# Altium schematic sheet USB3-HUB.SchDoc: TEBF0808 - USB
size A4; Organization: Trenz Electronic GmbH; DocumentNumber: TEBF0808; Revision: 04; SheetNumber: 15; SheetTotal: 36; Date: 2016-09-29; CompanyName: Trenz Electronic GmbH
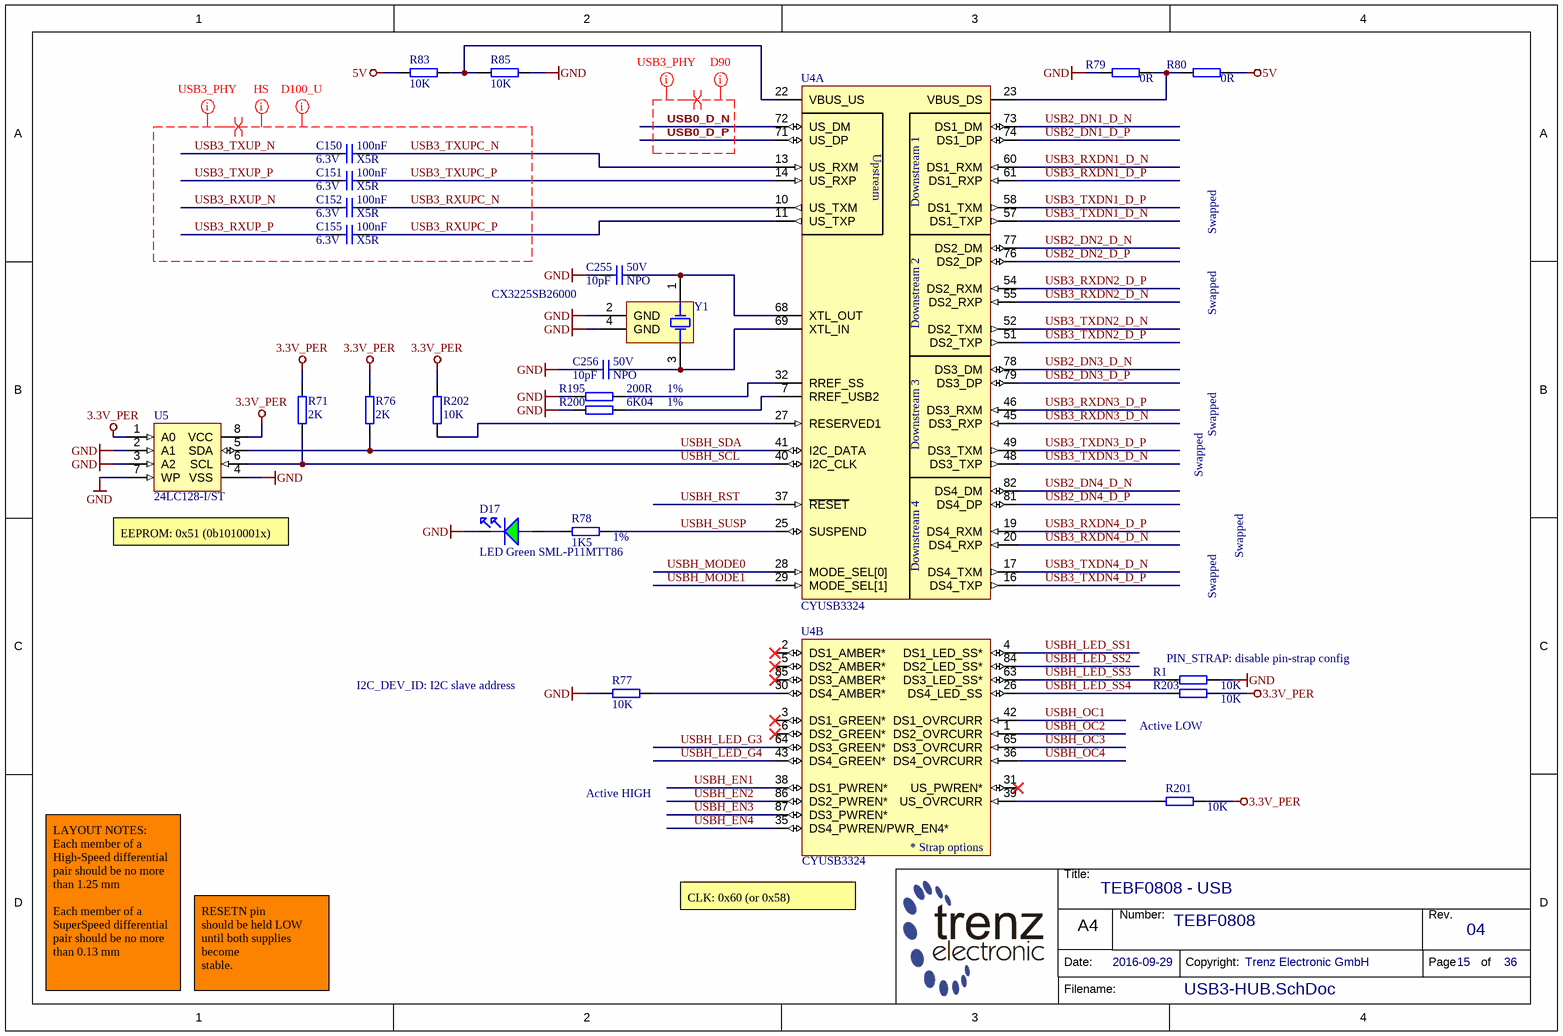
[diagram p0: USB3-HUB.SchDoc]

## Parts
C150  100nF  Voltage: 6.3V  Technology: X5R  [CAPC0603X33N]
C151  100nF  Voltage: 6.3V  Technology: X5R  [CAPC0603X33N]
C152  100nF  Voltage: 6.3V  Technology: X5R  [CAPC0603X33N]
C155  100nF  Voltage: 6.3V  Technology: X5R  [CAPC0603X33N]
C255  10pF  Voltage: 50V  Technology: NPO  [CAPC1005X55N]
C256  10pF  Voltage: 50V  Technology: NPO  [CAPC1005X55N]
D17  LED Green SML-P11MTT86  [LEDC1006X25N_GREEN]
R1  10K  [RESC1005X40N]
R71  2K  [RESC1005X40N]
R76  2K  [RESC1005X40N]
R77  10K  [RESC1005X40N]
R78  1K5  Tolerance: 1%  [RESC1005X40N]
R79  0R  [RESC1005X40N]
R80  0R  [RESC1005X40N]
R83  10K  [RESC1005X40N]
R85  10K  [RESC1005X40N]
R195  200R  Tolerance: 1%  [RESC1005X40N]
R200  6K04  Tolerance: 1%  [RESC1005X40N]
R201  10K  [RESC1005X40N]
R202  10K  [RESC1005X40N]
R203  10K  [RESC1005X40N]
U4  CYUSB3324  [QFN40P10X10X1-89T530]  (parts A,B of 3)
U5  24LC128-I/ST  [SOP65P640X120-8N-MC]
Y1  CX3225SB26000  [OSCCC320X250X60N]

## Nets
3.3V_PER: R71.2 R76.2 R201.1 R202.1 R203.1 U5.1(A0) U5.8(VCC)
5V: R80.1 R83.2
GND: C255.1 C256.1 D17.K R1.1 R77.1 R79.2 R85.1 R195.1 R200.1 U5.2(A1) U5.3(A2) U5.4(VSS) U5.7(WP) Y1.2(GND) Y1.4(GND)
USB0_D_N: U4.72(US_DM)
USB0_D_P: U4.71(US_DP)
USB2_DN1_D_N: U4.73(DS1_DM)
USB2_DN1_D_P: U4.74(DS1_DP)
USB2_DN2_D_N: U4.77(DS2_DM)
USB2_DN2_D_P: U4.76(DS2_DP)
USB2_DN3_D_N: U4.78(DS3_DM)
USB2_DN3_D_P: U4.79(DS3_DP)
USB2_DN4_D_N: U4.82(DS4_DM)
USB2_DN4_D_P: U4.81(DS4_DP)
USB3_RXDN1_D_N: U4.60(DS1_RXM)
USB3_RXDN1_D_P: U4.61(DS1_RXP)
USB3_RXDN2_D_N: U4.55(DS2_RXP)
USB3_RXDN2_D_P: U4.54(DS2_RXM)
USB3_RXDN3_D_N: U4.45(DS3_RXP)
USB3_RXDN3_D_P: U4.46(DS3_RXM)
USB3_RXDN4_D_N: U4.20(DS4_RXP)
USB3_RXDN4_D_P: U4.19(DS4_RXM)
USB3_RXUP_N: C152.1
USB3_RXUP_P: C155.1
USB3_RXUPC_N: C152.2 U4.10(US_TXM)
USB3_RXUPC_P: C155.2 U4.11(US_TXP)
USB3_TXDN1_D_N: U4.57(DS1_TXP)
USB3_TXDN1_D_P: U4.58(DS1_TXM)
USB3_TXDN2_D_N: U4.52(DS2_TXM)
USB3_TXDN2_D_P: U4.51(DS2_TXP)
USB3_TXDN3_D_N: U4.48(DS3_TXP)
USB3_TXDN3_D_P: U4.49(DS3_TXM)
USB3_TXDN4_D_N: U4.17(DS4_TXM)
USB3_TXDN4_D_P: U4.16(DS4_TXP)
USB3_TXUP_N: C150.1
USB3_TXUP_P: C151.1
USB3_TXUPC_N: C150.2 U4.13(US_RXM)
USB3_TXUPC_P: C151.2 U4.14(US_RXP)
USBH_EN1: U4.38(DS1_PWREN*)
USBH_EN2: U4.86(DS2_PWREN*)
USBH_EN3: U4.87(DS3_PWREN*)
USBH_EN4: U4.35(DS4_PWREN/PWR_EN4*)
USBH_LED_G3: U4.64(DS3_GREEN*)
USBH_LED_G4: U4.43(DS4_GREEN*)
USBH_LED_SS1: U4.4(DS1_LED_SS*)
USBH_LED_SS2: U4.84(DS2_LED_SS*)
USBH_LED_SS3: R1.2 U4.63(DS3_LED_SS*)
USBH_LED_SS4: R203.2 U4.26(DS4_LED_SS)
USBH_MODE0: U4.28(MODE_SEL[0])
USBH_MODE1: U4.29(MODE_SEL[1])
USBH_OC1: U4.42(DS1_OVRCURR)
USBH_OC2: U4.1(DS2_OVRCURR)
USBH_OC3: U4.65(DS3_OVRCURR)
USBH_OC4: U4.36(DS4_OVRCURR)
USBH_RST: U4.37(~{RESET})
USBH_SCL: R71.1 U4.40(I2C_CLK) U5.6(SCL)
USBH_SDA: R76.1 U4.41(I2C_DATA) U5.5(SDA)
USBH_SUSP: R78.1 U4.25(SUSPEND)
NetC255_2: C255.2 U4.68(XTL_OUT) Y1.1(OSC1)
NetC256_2: C256.2 U4.69(XTL_IN) Y1.3(OSC2)
NetD17_A: D17.A R78.2
NetR77_2: R77.2 U4.30(DS4_AMBER*)
NetR79_1: R79.1 R80.2 U4.23(VBUS_DS)
NetR83_1: R83.1 R85.2 U4.22(VBUS_US)
NetR195_2: R195.2 U4.32(RREF_SS)
NetR200_2: R200.2 U4.7(RREF_USB2)
NetR201_2: R201.2 U4.39(US_OVRCURR)
NetR202_2: R202.2 U4.27(RESERVED1)

Not connected (* = marked no-connect by the designer): U4 2(DS1_AMBER*)* 3(DS1_GREEN*)* 5(DS2_AMBER*)* 6(DS2_GREEN*)* 31(US_PWREN*)* 85(DS3_AMBER*)*

## Layout directives
net class USB3_PHY: USB0_D_N, USB0_D_P, USB3_RXUP_N, USB3_RXUP_P, USB3_RXUPC_N, USB3_RXUPC_P, USB3_TXUP_N, USB3_TXUP_P, USB3_TXUPC_N, USB3_TXUPC_P
differential pair: USB0_D_N, USB0_D_P, USB3_RXUP_N, USB3_RXUP_P, USB3_RXUPC_N, USB3_RXUPC_P, USB3_TXUP_N, USB3_TXUP_P, USB3_TXUPC_N, USB3_TXUPC_P
net class D90: USB0_D_N, USB0_D_P
net class HS: USB3_RXUP_N, USB3_RXUP_P, USB3_RXUPC_N, USB3_RXUPC_P, USB3_TXUP_N, USB3_TXUP_P, USB3_TXUPC_N, USB3_TXUPC_P
net class D100_U: USB3_RXUP_N, USB3_RXUP_P, USB3_RXUPC_N, USB3_RXUPC_P, USB3_TXUP_N, USB3_TXUP_P, USB3_TXUPC_N, USB3_TXUPC_P

## Notes on the sheet
- Swapped
- (near U5) EEPROM: 0x51 (0b1010001x)
- I2C_DEV_ID: I2C slave address
- (near R1) PIN_STRAP: disable pin-strap config
- Active LOW
- Active HIGH
- CLK: 0x60 (or 0x58)
- LAYOUT NOTES:
  Each member of a High-Speed differential pair should be no more than 1.25 mm
  Each member of a SuperSpeed differential pair should be no more than 0.13 mm
- RESETN pin
  should be held LOW until both supplies become
  stable.
- Title:
- Number:
- Rev.
- Date:
- A4
- Copyright:
- Page
- of
- Filename:
- (in symbol 27573, part A) Upstream; Downstream 1; Downstream 2; Downstream 3; Downstream 4
- (in symbol 27573, part B) * Strap options

## Library data of the parts
C150-C152 C155 = 24915: KON 100nF 6.3V X5R SMD 10%; AN: 24915; Mixed: SMT; Value: 100n; Preferred: Yes; Case: 0603 (0201); Tolerance: 10%
C255 C256 = 22597: KON 10pF NPO 50V SMD 5%; AN: 22597; Mixed: SMT; Value: 10p; Preferred: Yes; Case: 1005 (0402); Tolerance: 5%
D17 = 24211: LED Grün SML-P11MTT86 SMD; AN: 24211; Mixed: SMT; Preferred: Yes; Case: 1005 (0402); HelpURL: B:\AD\adlib\datasheet\SML-P1; H-ART: SML-P11MTT86
R1 R77 R83 R85 R201-R203 = 22750: WID SMD 10K 1% 0,063W; AN: 22750; Mixed: SMT; Preferred: Yes; Tolerance: 1%; Case: 1005 (0402); Technology: TK100; Value: 10K
R71 R76 = 25073: WID SMD 2K 1% 0,063W; AN: 25073; Mixed: SMT; Tolerance: 1%; Case: 1005 (0402); Technology: TK100; Value: 2K
R78 = 22602: WID SMD 1K5 1% 0,063W; AN: 22602; Mixed: SMT; Value: 1.5K; Preferred: Yes; Case: 1005 (0402); Technology: TK100
R79 R80 = 22738: WID SMD 0R; AN: 22738; Tolerance: 1%; Mixed: SMT; Value: 0; Preferred: Yes; Case: 1005 (0402); Technology: TK100
R195 = 22758: WID SMD 200R 1% 0,063W; AN: 22758; Mixed: SMT; Value: 200; Preferred: Yes; Case: 1005 (0402); Technology: TK100
R200 = 24678: WID SMD 6K04 1% 0,063W; AN: 24678; Mixed: SMT; Value: 6.04K; Preferred: Yes; Case: 1005 (0402); Technology: TK100
U4 = 27573: CYUSB3324-88LTXC USB 3.0 Hub; AN: 27573; Mixed: SMT; Case: QFN88; HelpURL: b:\AD\adlib\datasheet\CYUSBx30x\; H-ART: CYUSB3324-88LTXC
U5 = 22933: AN: 22933; Mixed: SMT; Trenz-Stock: Yes; Case: TSSOP8; HelpURL: B:\AD\adlib\datasheet\24LC128; Preferred: Yes; H-ART: 24LC128-I/ST
Y1 = 27574: Quarz Crystal 26Mhz 10ppm 8pF -20C +70°C; AN: 27574; Mixed: SMT; Value: 26M; H-ART: CX3225SB26000D0FFFCC; HelpURL: b:\AD\adlib\datasheet\CX3225\